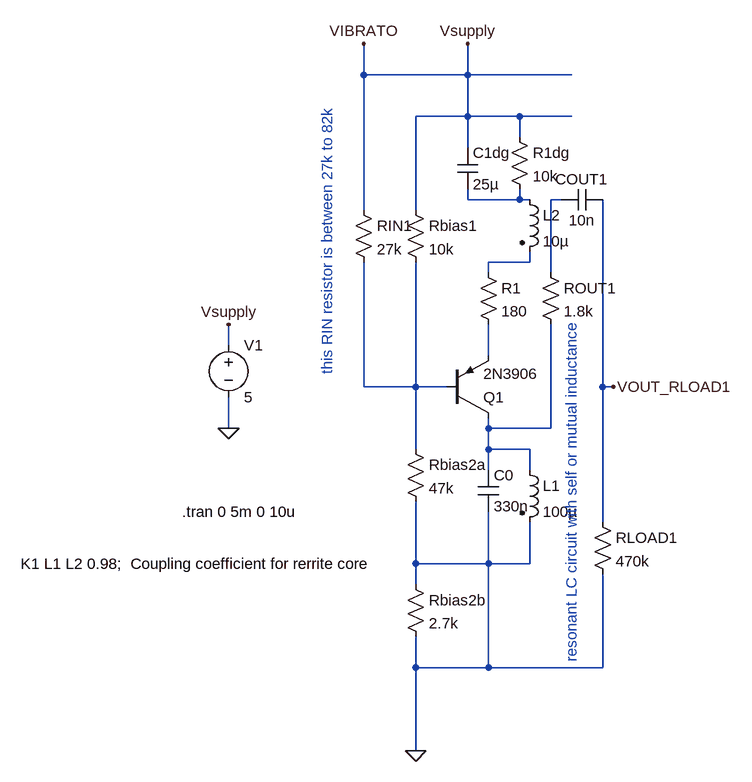
[diagram p0: schematic Farfisa Tone Generator Osc Card G-10.asc]
Farfisa Tone Generator Osc Card G-10.asc, the LTspice schematic file:
Version 4.1
SHEET 1 1924 820
WIRE -160 -240 -160 -288
WIRE 0 -240 0 -288
WIRE 0 -240 -160 -240
WIRE 160 -240 0 -240
WIRE 0 -176 0 -240
WIRE 0 -176 -80 -176
WIRE 80 -176 0 -176
WIRE 160 -176 80 -176
WIRE 80 -144 80 -176
WIRE 0 -128 0 -176
WIRE 0 -48 0 -64
WIRE 80 -48 80 -64
WIRE 80 -48 0 -48
WIRE 96 -48 80 -48
WIRE 144 -48 128 -48
WIRE -160 -32 -160 -240
WIRE -80 -32 -80 -176
WIRE 96 48 96 32
WIRE 96 48 32 48
WIRE 32 64 32 48
WIRE 128 64 128 -48
WIRE -368 176 -368 144
WIRE 32 192 32 144
WIRE -160 240 -160 48
WIRE -80 240 -80 48
WIRE -80 240 -160 240
WIRE -32 240 -80 240
WIRE 208 240 208 -48
WIRE 224 240 208 240
WIRE -368 304 -368 256
WIRE 32 304 32 288
WIRE 128 304 128 144
WIRE 128 304 32 304
WIRE -80 336 -80 240
WIRE 32 336 32 304
WIRE 96 336 32 336
WIRE 32 368 32 336
WIRE 96 368 96 336
WIRE 208 448 208 240
WIRE -80 512 -80 416
WIRE 32 512 32 432
WIRE 32 512 -80 512
WIRE 96 512 96 448
WIRE 96 512 32 512
WIRE -80 544 -80 512
WIRE -80 672 -80 624
WIRE 32 672 32 512
WIRE 32 672 -80 672
WIRE 208 672 208 528
WIRE 208 672 32 672
WIRE -80 800 -80 672
FLAG -80 800 0
FLAG -368 304 0
FLAG -368 144 Vsupply
FLAG -160 -288 VIBRATO
FLAG 0 -288 Vsupply
FLAG 224 240 VOUT_RLOAD1
SYMBOL pnp -32 288 M180
SYMATTR InstName Q1
SYMATTR Value 2N3906
SYMBOL Res 16 48 R0
SYMATTR InstName R1
SYMATTR Value 180
SYMBOL ind2 80 -64 R0
SYMATTR InstName L2
SYMATTR Value 10µ
SYMATTR Type ind
SYMBOL Cap -16 -128 R0
SYMATTR InstName C1dg
SYMATTR Value 25µ
SYMBOL Res 64 -160 R0
SYMATTR InstName R1dg
SYMATTR Value 10k
SYMBOL Cap 16 368 R0
SYMATTR InstName C0
SYMATTR Value 330n
SYMBOL ind2 80 352 R0
SYMATTR InstName L1
SYMATTR Value 100µ
SYMATTR Type ind
SYMBOL Res -96 320 R0
SYMATTR InstName Rbias2a
SYMATTR Value 47k
SYMBOL Res -96 528 R0
SYMATTR InstName Rbias2b
SYMATTR Value 2.7k
SYMBOL Res -96 -48 R0
SYMATTR InstName Rbias1
SYMATTR Value 10k
SYMBOL Res -176 -48 R0
SYMATTR InstName RIN1
SYMATTR Value 27k
SYMBOL Res 112 48 R0
SYMATTR InstName ROUT1
SYMATTR Value 1.8k
SYMBOL Cap 208 -64 R90
WINDOW 0 0 32 VBottom 2
WINDOW 3 32 32 VTop 2
SYMATTR InstName COUT1
SYMATTR Value 10n
SYMBOL Res 192 432 R0
SYMATTR InstName RLOAD1
SYMATTR Value 470k
SYMBOL Voltage -368 160 R0
SYMATTR InstName V1
SYMATTR Value 5
TEXT 160 136 VRight 2 ;resonant LC circuit with self or mutual inductance
TEXT -216 -192 VRight 2 ;this RIN resistor is between 27k to 82k
TEXT -688 512 Left 2 !K1 L1 L2 0.98;  Coupling coefficient for rerrite core
TEXT -440 432 Left 2 !.tran 0 5m 0 10u

The netlist it stands for:
* Farfisa Tone Generator Osc Card G-10.asc
Q1 N006 N005 N004 0 2N3906
R1 N003 N004 180
L2 N001 N003 10µ
C1dg VIBRATO N001 25µ
R1dg VIBRATO N001 10k
C0 N006 0 330n
L1 N006 0 100µ
Rbias2a N005 0 47k
Rbias2b 0 0 2.7k
Rbias1 VIBRATO N005 10k
RIN1 VIBRATO N005 27k
ROUT1 N002 N006 1.8k
COUT1 VOUT_RLOAD1 N002 10n
RLOAD1 VOUT_RLOAD1 0 470k
V1 VIBRATO 0 5
.model NPN NPN
.model PNP PNP
.lib standard.bjt
* resonant LC circuit with self or mutual inductance
* this RIN resistor is between 27k to 82k
K1 L1 L2 0.98;  Coupling coefficient for rerrite core
.tran 0 5m 0 10u
.backanno
.end